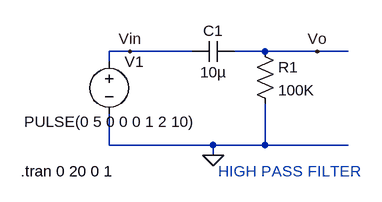
[diagram p0: schematic HIGH PASS FILTER CHARGING AND DISCHARGING.asc]
HIGH PASS FILTER CHARGING AND DISCHARGING.asc, the LTspice schematic file:
Version 4
SHEET 1 880 680
WIRE 0 128 -32 128
WIRE 96 128 0 128
WIRE 208 128 160 128
WIRE 288 128 208 128
WIRE 336 128 288 128
WIRE -32 144 -32 128
WIRE -32 272 -32 224
WIRE 128 272 -32 272
WIRE 208 272 208 208
WIRE 208 272 128 272
WIRE 336 272 208 272
WIRE 128 288 128 272
FLAG 128 288 0
FLAG 288 128 Vo
FLAG 0 128 Vin
SYMBOL res 192 112 R0
SYMATTR InstName R1
SYMATTR Value 100K
SYMBOL cap 96 144 R270
WINDOW 0 32 32 VTop 2
WINDOW 3 0 32 VBottom 2
SYMATTR InstName C1
SYMATTR Value 10µ
SYMBOL voltage -32 128 R0
WINDOW 3 -131 108 Left 2
WINDOW 123 0 0 Left 2
WINDOW 39 0 0 Left 2
SYMATTR Value PULSE(0 5 0 0 0 1 2 10)
SYMATTR InstName V1
TEXT -168 312 Left 2 !.tran 0 20 0 1
TEXT 136 312 Left 2 ;HIGH PASS FILTER

The netlist it stands for:
* HIGH PASS FILTER CHARGING AND DISCHARGING.asc
R1 Vo 0 100K
C1 Vin Vo 10µ
V1 Vin 0 PULSE(0 5 0 0 0 1 2 10)
.tran 0 20 0 1
* HIGH PASS FILTER
.backanno
.end

* Results of the author's LTspice run, read from the files saved beside the schematic
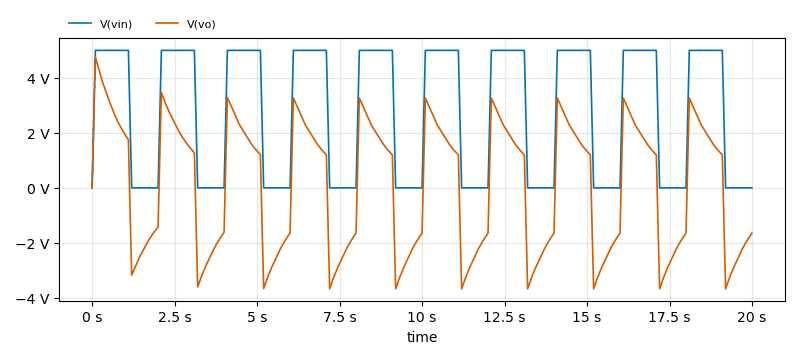
[diagram p1: Transient Analysis of HIGH PASS FILTER CHARGING AND DISCHARGING.asc, plotted from the saved traces]
* Transient Analysis, 1 run:
*   V(vin): min 0 V, max 5 V, average 2.75 V, rms 3.657 V, last 0 V
*   V(vo): min -3.671 V, max 4.758 V, average 87.92 mV, rms 2.392 V, last -1.646 V